# Altium schematic sheet CAN_Connections.SchDoc
size A
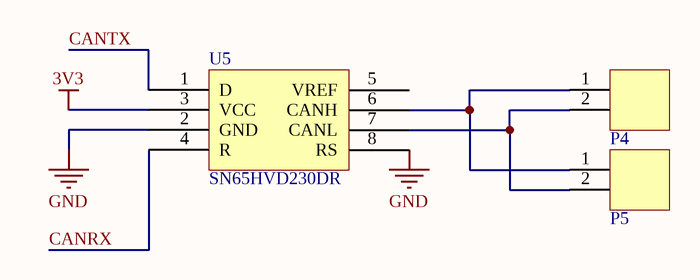
[diagram p0: CAN_Connections.SchDoc]

## Parts
P4  2-pin Horz Sherlock  [MOLEX-HDR-1X2-SHERLOCK-HORZ]  (value not drawn)
P5  2-pin Horz Sherlock  [MOLEX-HDR-1X2-SHERLOCK-HORZ]  (value not drawn)
U5  SN65HVD230DR  [SOIC-8pin]

## Nets
3V3: U5.3(VCC)
GND: U5.2(GND) U5.8(RS)
CANRX: U5.4(R)
CANTX: U5.1(D)
NetP4_1: P4.1 P5.1 U5.6(CANH)
NetP4_2: P4.2 P5.2 U5.7(CANL)

Not connected (* = marked no-connect by the designer): U5 5(VREF)

## Library data of the parts
P4 P5 = MOLEX-HDR-1x2-SHERLOCK_RA: Header, Molex, 2mm Pitch Sherlock Header, Single Row, Horizontal, 2 Circuits, Length 3.3mm,  0353630260; Manufacturer: Molex Inc; Manufacturer Part Number: 0353630260; Supplier Part Number 1: WM18931-ND; Supplier 1: Digi-Key
U5 = SN65HVD230DR: IC TXRX CAN 1MBPS 3.3V 8SOIC; Supplier 1: Digi-Key; Supplier Part Numbe 1: 296-11654-1-ND